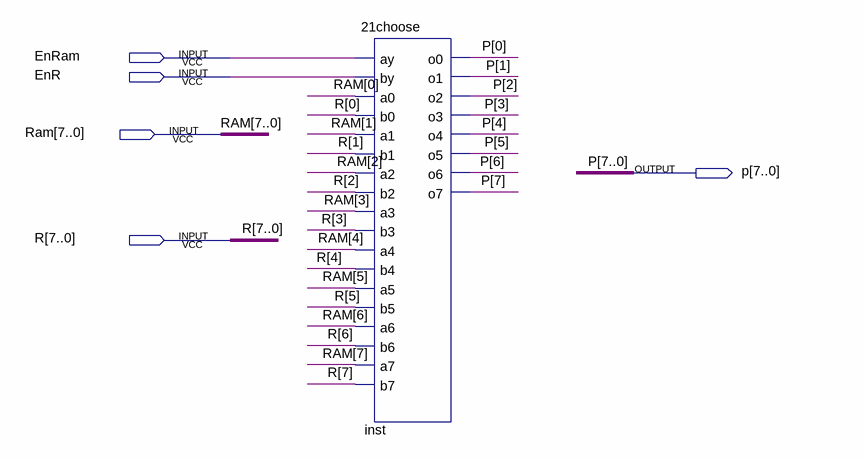
[diagram p0: schematic sheet]
// Quartus schematic CHOSE.bdf as structural Verilog: 1 symbols, 5 pins
module CHOSE (
  input  EnRam,
  input  EnR,
  input  [7:0] Ram,
  input  [7:0] R,
  output [7:0] p
);

  \21choose  inst (
    .ay(EnRam), .by(EnR), .a0(Ram[0]), .b0(R[0]), .a1(Ram[1]), .b1(R[1]), .a2(Ram[2]), .b2(R[2]),
    .a3(Ram[3]), .b3(R[3]), .a4(Ram[4]), .b4(R[4]), .a5(Ram[5]), .b5(R[5]), .a6(Ram[6]), .b6(R[6]),
    .a7(Ram[7]), .b7(R[7]), .o0(p[0]), .o1(p[1]), .o2(p[2]), .o3(p[3]), .o4(p[4]), .o5(p[5]), .o6(p[6]),
    .o7(p[7]));
endmodule
